# EAGLE design COMP2 (EAGLE 8.2.2)

## Sheet 1 of 3
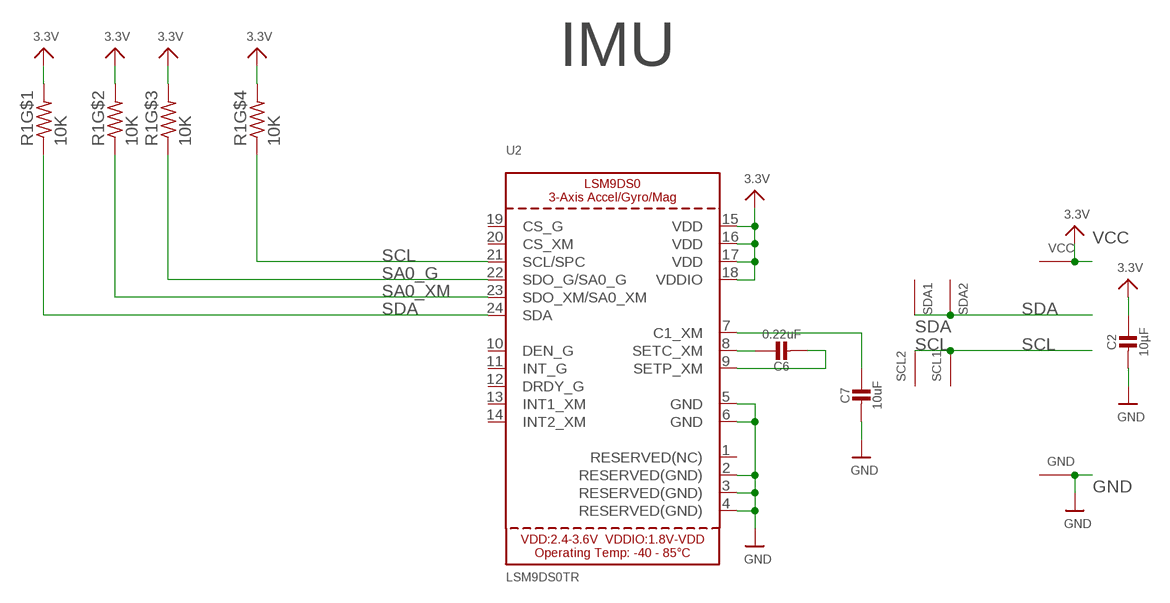
[diagram p0: schematic, sheet 1]

### Parts
C2  10µF  CAP_CERAMIC0805_10MGAP  [0805_10MGAP]
C6  0.22uF  CAP_CERAMIC0805-NOOUTLINE  [0805-NO]
C7  10uF  CAP_CERAMIC0805-NOOUTLINE  [0805-NO]
GND  SEWTAP0.5IN  [SEWINGTAP_0.5]
R1  10K  RESISTOR_4PACK_US  [RESPACK_4X0603]
SCL1  SEWTAP0.5IN  [SEWINGTAP_0.5]
SCL2  SEWTAP0.5IN  [SEWINGTAP_0.5]
SDA1  SEWTAP0.5IN  [SEWINGTAP_0.5]
SDA2  SEWTAP0.5IN  [SEWINGTAP_0.5]
U2  LSM9DS0TR  LSM9DS0  [LGA24_4X4MM]
VCC  SEWTAP0.5IN  [SEWINGTAP_0.5]

### Nets
GND: C2.2 C7.2 GND.TAP(SEW) U2.2(RESERVED(GND)) U2.3(RESERVED(GND)) U2.4(RESERVED(GND)) U2.5(GND) U2.6(GND) ; also sheet 2,3
N$1: C6.1 U2.8(SETC_XM)
N$2: C6.2 U2.9(SETP_XM)
N$6: C7.1 U2.7(C1_XM)
SA0_G: R1.3 U2.22(SDO_G/SA0_G)
SA0_XM: R1.2 U2.23(SDO_XM/SA0_XM)
SCL: R1.4 SCL1.TAP(SEW) SCL2.TAP(SEW) U2.21(SCL/SPC) ; also sheet 2,3
SDA: R1.1 SDA1.TAP(SEW) SDA2.TAP(SEW) U2.24(SDA) ; also sheet 2,3
VCC: C2.1 R1.5 R1.6 R1.7 R1.8 U2.15(VDD) U2.16(VDD) U2.17(VDD) U2.18(VDDIO) VCC.TAP(SEW) ; supply symbol labelled 3.3V ; also sheet 2,3
Unconnected: U2.1(RESERVED(NC)) U2.10(DEN_G) U2.11(INT_G) U2.12(DRDY_G) U2.13(INT1_XM) U2.14(INT2_XM) U2.19(CS_G) U2.20(CS_XM)

### Notes on the sheet
- IMU

## Sheet 2 of 3
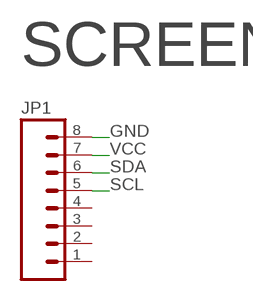
[diagram p1: schematic, sheet 2]

### Parts
JP1  M08LOCK  [1X08_LOCK]

### Nets
GND: JP1.8 ; also sheet 1,3
SCL: JP1.5 ; also sheet 1,3
SDA: JP1.6 ; also sheet 1,3
VCC: JP1.7 ; also sheet 1,3
Unconnected: JP1.1 JP1.2 JP1.3 JP1.4

### Notes on the sheet
- SCREEN

## Sheet 3 of 3
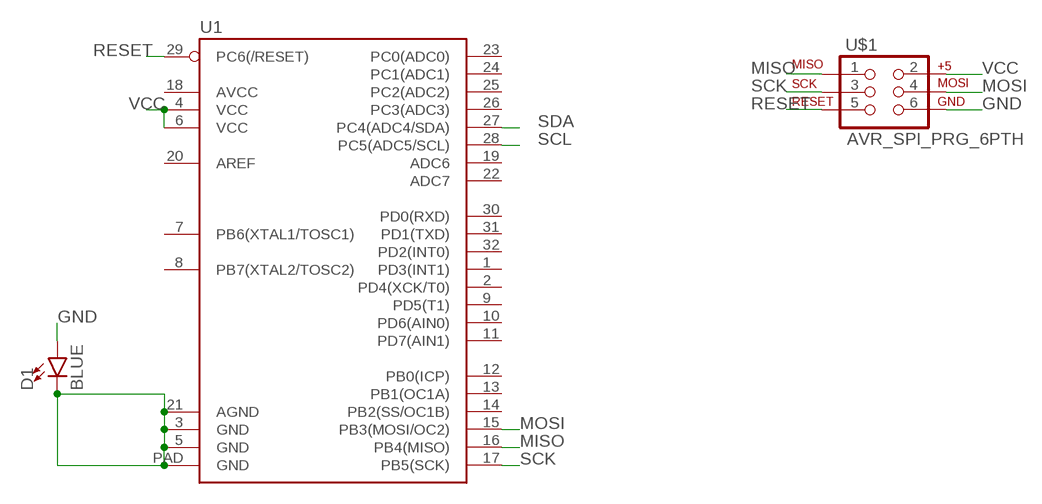
[diagram p2: schematic, sheet 3]

### Parts
D1  BLUE  LED-BLUE0603  [LED-0603]
U1  ATMEGA328P_MLFMLF32  [MLF32-PAD]
U$1  AVR_SPI_PRG_6PTH  [2X3]

### Nets
GND: D1.A U$1.6 ; also sheet 1,2
MISO: U1.16(PB4(MISO)) U$1.1
MOSI: U1.15(PB3(MOSI/OC2)) U$1.4
N$4: D1.C U1.3(GND) U1.5(GND) U1.21(AGND) U1.PAD(GND)
RESET: U1.29(PC6(/RESET)) U$1.5
SCK: U1.17(PB5(SCK)) U$1.3
SCL: U1.28(PC5(ADC5/SCL)) ; also sheet 1,2
SDA: U1.27(PC4(ADC4/SDA)) ; also sheet 1,2
VCC: U1.4(VCC) U1.6(VCC) U$1.2 ; also sheet 1,2
Unconnected: U1.1(PD3(INT1)) U1.2(PD4(XCK/T0)) U1.7(PB6(XTAL1/TOSC1)) U1.8(PB7(XTAL2/TOSC2)) U1.9(PD5(T1)) U1.10(PD6(AIN0)) U1.11(PD7(AIN1)) U1.12(PB0(ICP)) U1.13(PB1(OC1A)) U1.14(PB2(SS/OC1B)) U1.18(AVCC) U1.19(ADC6) U1.20(AREF) U1.22(ADC7) U1.23(PC0(ADC0)) U1.24(PC1(ADC1)) U1.25(PC2(ADC2)) U1.26(PC3(ADC3)) U1.30(PD0(RXD)) U1.31(PD1(TXD)) U1.32(PD2(INT0))

## Library data of the parts
C2 C7 = microbuilder:CAP_CERAMIC: Ceramic Capacitors For new designs, use the packages preceded by an '_' character since they are more reliable: The following footprints should be used on most boards: _0402 - Standard footprint for regular board layouts _0603 - Standard footprint for regular board layouts _0805 - Standard footprint for regular board layouts _1206 - Standard footprint for regular board layouts For extremely tight-pitch boards where space is at a premium, the following 'micro-pitch' footprints can be used (smaller pads, no silkscreen outline, etc.): _0402MP - Micro-pitch footprint for very dense/compact boards _0603MP - Micro-pitch footprint for very dense/compact boards _0805MP - Micro-pitch footprint for very dense/compact boards _1206MP - Micro-pitch footprint for very dense/compact boards; MPN: GRM21BC80J106KE19L; OC_NEWARK: 03AC2709
C6 = microbuilder:CAP_CERAMIC: Ceramic Capacitors For new designs, use the packages preceded by an '_' character since they are more reliable: The following footprints should be used on most boards: _0402 - Standard footprint for regular board layouts _0603 - Standard footprint for regular board layouts _0805 - Standard footprint for regular board layouts _1206 - Standard footprint for regular board layouts For extremely tight-pitch boards where space is at a premium, the following 'micro-pitch' footprints can be used (smaller pads, no silkscreen outline, etc.): _0402MP - Micro-pitch footprint for very dense/compact boards _0603MP - Micro-pitch footprint for very dense/compact boards _0805MP - Micro-pitch footprint for very dense/compact boards _1206MP - Micro-pitch footprint for very dense/compact boards; MPN: C0805J224K3RACAUTO; OC_NEWARK: 02AC3540
D1 = SparkFun-LED:LED-BLUE: Blue SMD LED Used in manufacturing of various products at SparkFun Packages: 0603 - SMD 0603 package [Product Link] <http://www.digikey.com/product-detail/en/SMLE12BC7TT86/511-1589-2-ND/1641808> 1206 - SMD1206 package [Product Link] <http://www.digikey.com/product-detail/en/lite-on-inc/LTST-C150TBKT/160-1643-1-ND/573584> SparkFun Products: ESP8266 Thing-Dev Board <https://www.sparkfun.com/products/13711> RedBoard <https://www.sparkfun.com/products/12757>; MPN: HSMR-C120; OC_NEWARK: 97K1682; PROD_ID: DIO-08575
GND SCL1 SCL2 SDA1 SDA2 VCC = adafruit:SEWTAP; OC_NEWARK: unknown
JP1 = SparkFun:M08: Header 8 Standard 8-pin 0.1" header. Use with straight break away headers (SKU : PRT-00116), right angle break away headers (PRT-00553), swiss pins (PRT-00743), machine pins (PRT-00117), and female headers (PRT-00115).; OC_NEWARK: unknown
R1 = microbuilder:RESISTOR_4PACK_US: Resistor Packs (4 resistors) 4 x 0603 10K 1/16W - Digikey: YC164J-10KCT-ND; MF: VISHAY/DALE; MPN: TNPW060310K0BETA; OC_NEWARK: 31K9698
U1 = SparkFun-IC-Microcontroller:ATMEGA328P_MLF: Datasheet SparkFun Products () () 32-Pin Atmega328 part Commonly used on Arduino compatible boards Available in QFP and QFN packages TQFP is IC-09069 QFN is non-stock; MPN: ATMEGA8A-MU; OC_NEWARK: 15AC6102
U2 = microbuilder:LSM9DS0: LSM9DS0 3-Axis Accelerometer/Gyroscope/Magnetometer ±2/±4/±6/±8/±16 g linear acceleration ±2/±4/±8/±12 gauss magnetic ±245/±500/±2000 dps angular rate I2C/SPI Interface 2.4-3.6V Supply, 1.8V - VDD Logic; MPN: LSM9DS0TR; OC_NEWARK: 06X3494
U$1 = SparkFun:AVR_SPI_PRG_6: AVR ISP 6 Pin This is the reduced ISP connector for AVR programming. Common on Arduino. This footprint will take up less PCB space and can be used with a 10-pin to 6-pin adapter such as SKU: BOB-08508; OC_NEWARK: unknown

## Board
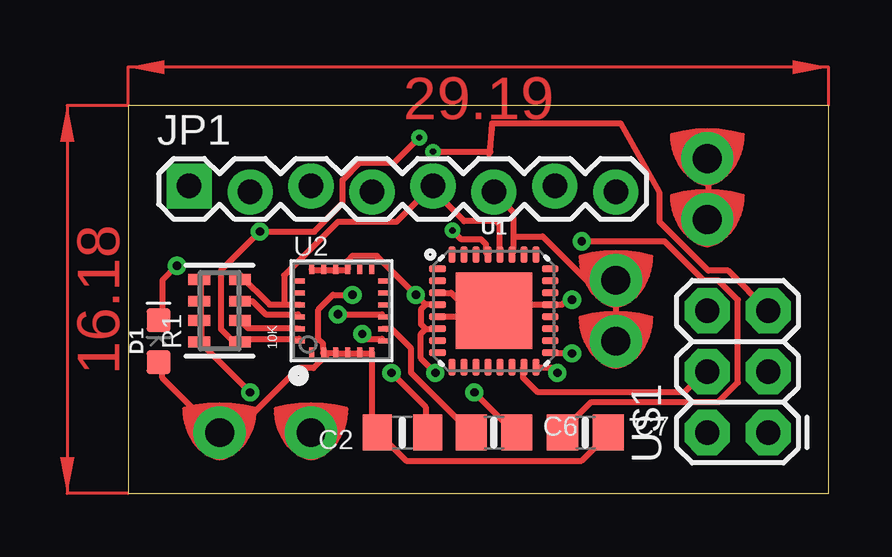
[diagram p3: board, top side]
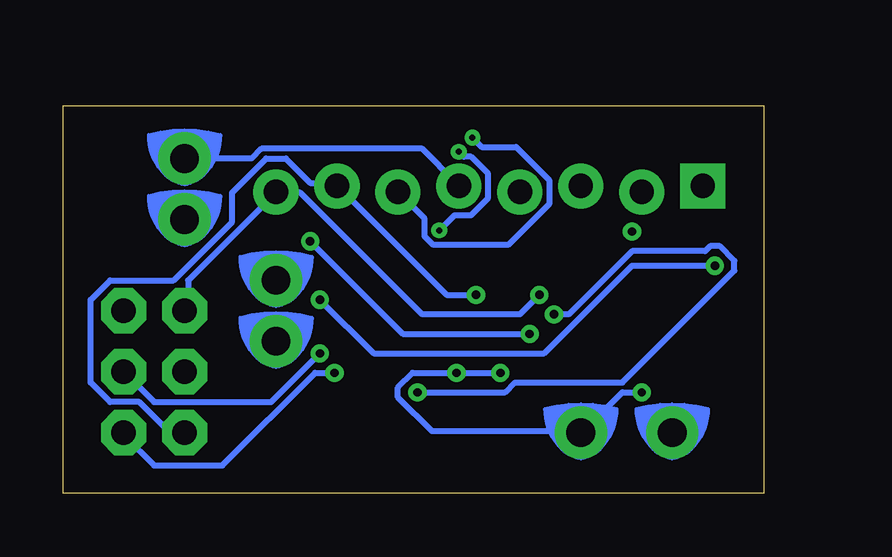
[diagram p4: board, bottom side, seen from below]

Size 29.19 x 16.18 mm. Coordinates in mm from the lower left corner, seen from the top.
Outline: 0,0 29.19,0 29.19,16.18 0,16.18 0,0
Copper layers (1*16): Top 0.035mm / dielectric 1.5mm / Bottom 0.035mm
Design rules "default *": minimum track width 10mil, minimum drill 0.35mm, track to track 6mil, track to pad 6mil, pad to pad 6mil, via to via 6mil, smd to smd 6mil, copper to edge 40mil, drill to drill 6mil, minimum pad ring 10mil, minimum via ring 8mil, stop-mask expansion 4mil, vias tented up to drill 0mil, thermal gap 10mil

### Footprints (pad centres in the part's own frame; a part is rotated, then mirrored left to right if it is on the bottom)
0805_10MGAP = smd 1.2 x 1.5: 1 -1.05,0; 2 1.05,0
0805-NO = smd 1.3 x 1.5: 1 -0.95,0; 2 0.95,0
LED-0603 = smd 1 x 1: A -0.877,0; C 0.877,0
SEWINGTAP_0.5 = drill 1.2 pad 2.184: TAP 0,0
1X08_LOCK = drill 1.016 pad 1.88 square: 1 0,0.127 | drill 1.016 pad 1.88: 2 2.54,-0.127; 3 5.08,0.127; 4 7.62,-0.127; 5 10.16,0.127; 6 12.7,-0.127; 7 15.24,0.127; 8 17.78,-0.127
RESPACK_4X0603 = smd 0.45 x 0.9: 1 -1.3,-0.85; 2 -0.4,-0.85; 3 0.4,-0.85; 4 1.3,-0.85; 5 1.3,0.85; 6 0.4,0.85; 7 -0.4,0.85; 8 -1.3,0.85
MLF32-PAD = smd 0.7 x 0.3: 1 -2.35,1.75; 2 -2.35,1.25; 3 -2.35,0.75; 4 -2.35,0.25; 5 -2.35,-0.25; 6 -2.35,-0.75; 7 -2.35,-1.25; 8 -2.35,-1.75; 17 2.35,-1.75; 18 2.35,-1.25; 19 2.35,-0.75; 20 2.35,-0.25; 21 2.35,0.25; 22 2.35,0.75; 23 2.35,1.25; 24 2.35,1.75 | smd 0.3 x 0.7: 9 -1.75,-2.35; 10 -1.25,-2.35; 11 -0.75,-2.35; 12 -0.25,-2.35; 13 0.25,-2.35; 14 0.75,-2.35; 15 1.25,-2.35; 16 1.75,-2.35; 25 1.75,2.35; 26 1.25,2.35; 27 0.75,2.35; 28 0.25,2.35; 29 -0.25,2.35; 30 -0.75,2.35; 31 -1.25,2.35; 32 -1.75,2.35 | smd 3.2 x 3.2: PAD 0,0
LGA24_4X4MM = smd 0.21 x 0.4: 1 -1.25,-1.725; 2 -0.75,-1.725; 3 -0.25,-1.725; 4 0.25,-1.725; 5 0.75,-1.725; 6 1.25,-1.725; 13 1.25,1.725; 14 0.75,1.725; 15 0.25,1.725; 16 -0.25,1.725; 17 -0.75,1.725; 18 -1.25,1.725 | smd 0.4 x 0.21: 7 1.725,-1.25; 8 1.725,-0.75; 9 1.725,-0.25; 10 1.725,0.25; 11 1.725,0.75; 12 1.725,1.25; 19 -1.725,1.25; 20 -1.725,0.75; 21 -1.725,0.25; 22 -1.725,-0.25; 23 -1.725,-0.75; 24 -1.725,-1.25
2X3 = drill 1.016 pad 1.88 octagon: 1 0,0; 2 0,2.54; 3 2.54,0; 4 2.54,2.54; 5 5.08,0; 6 5.08,2.54

### Placement (x,y rotation side)
C2  11.43,2.54 180 top
C6  15.24,2.54 0 top
C7  19.05,2.54 0 top
D1  1.27,6.35 90 top
GND  3.81,2.54 0 top
JP1  2.54,12.7 0 top
R1  3.81,7.62 90 top
SCL1  24.13,11.43 0 top
SCL2  24.13,13.97 0 top
SDA1  20.32,6.35 0 top
SDA2  20.32,8.89 0 top
U1  15.24,7.62 0 top
U2  8.89,7.62 0 top
U$1  26.67,2.54 90 top
VCC  7.62,2.54 0 top

### Tracks (layer width: path | path; a pad name or v marks a point on that pad's centre or on a via)
GND  (via drill 0.35)
  Top 0.254: D1.A 1.42,5.44 1.42,4.83 3.66,2.59 GND.TAP 3.86,2.59 4.47,2.59 7.11,5.23 7.72,5.23 8.33,5.84 | 8.74,5.84 8.33,5.84 | 8.33,5.84 8.13,5.84 U2.2 8.13,6.04 8.13,6.25 7.92,6.45 7.92,7.67 8.53,8.28 v9.35,8.28 | 8.74,5.84 9.14,5.84 | 8.74,5.84 U2.3 | 9.14,5.84 9.55,5.84 U2.5 9.75,5.84 10.16,5.84 | 9.14,5.84 U2.4 | 10.16,5.84 10.16,2.79 10.36,2.59 C2.2 10.57,2.39 11.58,1.37 18.9,1.37 19.91,2.39 C7.2 | 10.16,5.84 U2.6
  Bottom 0.254: 20.32,12.55 23.98,8.89 23.98,7.67 U$1.6 | 20.32,12.55 19.3,12.55 14.22,7.47 10.16,7.47 v9.35,8.28 | 20.32,12.55 JP1.8
MISO  (via drill 0.35)
  Top 0.254: v17.88,5.03 17.68,5.23 17.07,5.23 U1.16
  Bottom 0.254: v17.88,5.03 18.69,5.03 22.55,1.17 25.4,1.17 26.62,2.39 U$1.1
MOSI
  Top 0.254: U1.15 16.46,5.23 16.46,4.83 17.07,4.22 23.16,4.22 23.98,5.03 U$1.4
N$1
  Top 0.254: U2.8 10.77,6.86 10.97,6.86 11.79,6.04 11.79,5.03 14.22,2.59 C6.1
N$2  (via drill 0.35)
  Top 0.254: v8.74,7.47 10.57,7.47 U2.9 | v14.43,4.22 16.05,2.59 C6.2
  Bottom 0.254: v8.74,7.47 8.13,7.47 5.49,10.11 2.44,10.11 2.23,10.31 1.83,10.31 1.22,9.7 1.22,9.3 5.89,4.62 10.36,4.62 10.77,4.22 v14.43,4.22
N$4  (via drill 0.35)
  Top 0.254: v2.03,9.5 1.42,8.89 1.42,7.26 D1.C | v18.49,8.08 18.29,8.08 18.09,7.87 17.68,7.87 U1.21 17.48,7.87 15.44,7.87 15.24,7.67 U1.PAD 14.99,7.37 14.46,7.37 | 14.46,7.37 U1.5 | U1.3 13.46,8.37 14.46,7.37
  Bottom 0.254: v2.03,9.5 5.49,9.5 9.14,5.84 16.26,5.84 v18.49,8.08
N$6  (via drill 0.35)
  Top 0.254: v9.75,6.65 9.96,6.45 10.57,6.45 U2.7 | v18.9,10.52 22.35,10.52 23.98,8.89 24.59,8.89 25.4,8.08 25.4,4.62 24.59,3.81 19.3,3.81 18.09,2.59 C7.1
  Bottom 0.254: v9.75,6.65 15.04,6.65 v18.9,10.52
RESET  (via drill 0.25 pad 0.25)
  Top 0.254: 15.17,15.44 20.52,15.44 22.15,12.55 22.15,11.33 24.18,9.3 24.99,9.3 U$1.5 | 15.17,15.44 15.04,14.17 | 15.04,10.11 U1.29 14.92,10.04 14.92,10.39 14.71,10.6 13.89,10.6 v13.51,10.97 | v12.7,14.25 15.09,14.25 15.17,15.44
  Bottom 0.254: v13.51,10.97 12.88,11.61 12.2,11.61 11.48,12.32 11.48,13.33 12.2,14.05 12.5,14.05 v12.7,14.25
SA0_G
  Top 0.254: R1.3 5.17,8.02 5.72,7.47 7.07,7.47 U2.22
SA0_XM
  Top 0.254: U2.23 7.1,6.87 7.03,6.88 5,6.88 R1.2
SCK  (via drill 0.35)
  Top 0.254: v18.49,5.84 17.68,5.84 U1.17
  Bottom 0.254: v18.49,5.84 20.52,3.81 25.4,3.81 U$1.3
SCL
  Top 0.254: SCL1.TAP 24.18,11.53 24.18,13.97 SCL2.TAP | 6.5,7.87 5.89,7.87 4.67,9.09 R1.4 | 6.5,7.87 7.11,7.87 U2.21 | 6.5,7.87 6.5,9.09 8.74,11.33 11.18,11.33 12.6,12.75 | 12.6,12.75 JP1.5 | U1.28 15.49,11.18 15.32,11.35 13.99,11.35 12.6,12.75
  Bottom 0.254: SCL2.TAP 21.34,13.97 20.93,14.38 14.22,14.38 12.8,12.95 JP1.5
SDA  (via drill 0.25 pad 0.25, 0.35)
  Top 0.254: SDA1.TAP SDA2.TAP 19.1,8.89 17.27,10.72 16.05,10.72 | U2.24 7.11,6.45 4.67,6.45 R1.1 4.47,6.45 4.27,6.45 3.86,6.86 3.86,9.3 v5.49,10.92 7.76,10.92 8.94,12.11 8.94,13.08 9.65,13.79 11.09,13.79 v12.13,14.83 | 16.05,10.72 16.05,11.74 15.24,12.55 JP1.6 | 16.05,10.72 16.05,10.11 U1.27
  Bottom 0.254: 15.24,12.55 JP1.6 14.12,11.46 14.12,10.72 13.77,10.36 10.64,10.36 8.94,12.07 8.94,13.08 10.31,14.45 11.75,14.45 v12.13,14.83
VCC  (via drill 0.35)
  Top 0.254: 8.13,9.3 7.72,9.3 U2.18 | 8.13,9.3 8.53,9.3 U2.16 8.74,9.3 9.14,9.3 U2.15 9.14,9.5 9.14,9.7 9.35,9.91 10.36,9.91 v11.99,8.28 12.39,7.87 | 8.13,9.3 U2.17 | 12.39,6.86 12.8,6.86 U1.6 | 12.39,6.86 12.19,7.06 12.19,7.67 12.39,7.87 | 12.39,7.87 12.8,7.87 U1.4 | R1.5 3.05,8.89 3.05,8.08 R1.6 3.05,7.87 3.05,7.26 R1.7 3.05,7.06 3.05,6.45 R1.8 3.05,6.25 v5.08,4.22 | v10.97,5.03 12.39,3.61 12.39,2.59 C2.1 | 12.39,6.86 12.19,6.65 12.19,5.64 v12.8,5.03
  Bottom 0.254: v10.97,5.03 v12.8,5.03 14.63,5.03 15.24,4.42 15.24,4.01 13.82,2.59 7.72,2.59 VCC.TAP 7.52,2.59 5.89,4.22 v5.08,4.22 | U$1.2 24.18,2.59 24.79,2.59 26.01,3.81 27.23,3.81 28.04,4.62 28.04,8.08 27.23,8.89 24.59,8.89 22.15,11.33 22.15,12.55 20.73,13.97 19.91,13.97 18.9,12.95 17.88,12.95 JP1.7 17.68,12.75 13.21,8.28 v11.99,8.28
(copper drawn outside any net)
  shapes: Top area x2